# Altium project SLAVE_HW.PrjPcb (part 2 of 2)

## Sheet [4]Communication.SchDoc
size A4; DocumentNumber: 5; SheetNumber: 5; SheetTotal: 5
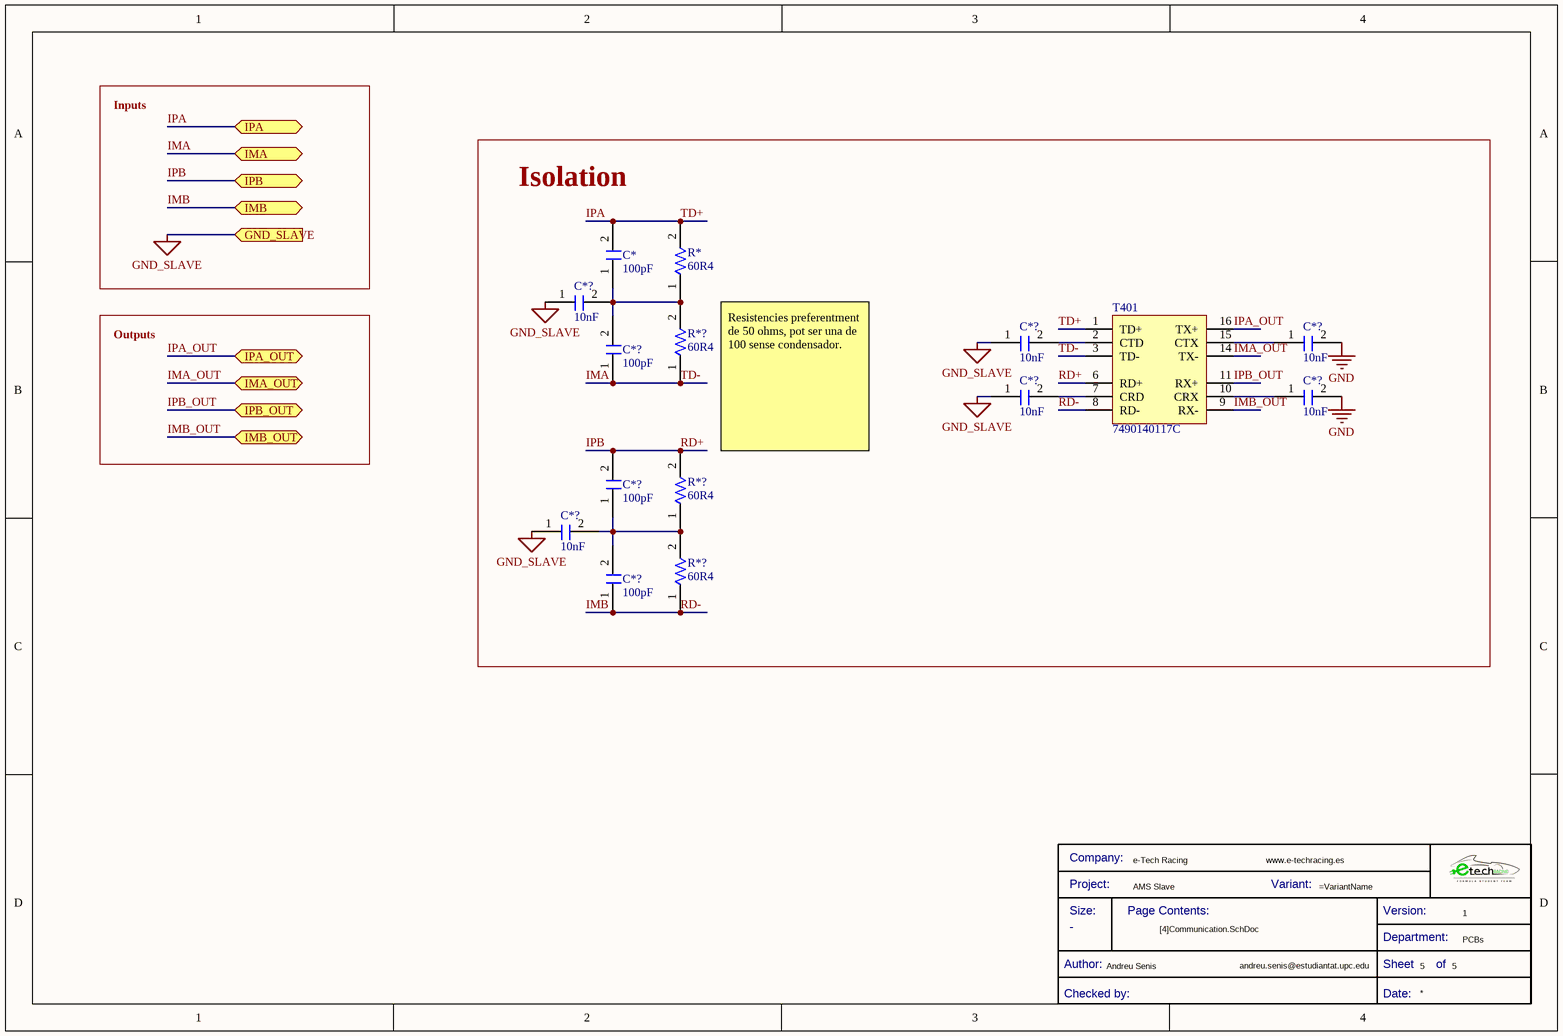
[diagram p4: [4]Communication.SchDoc]

### Parts
(Parts that share a designator on the sheet are numbered #1, #2 ... from top to bottom, then left to right.)
*?#4  Title Block_template  (value not drawn)  (graphical)
C*  Capacitance: 100pF  [C0805FNPC-W]  (hidden comment: 885012007057)
C*?#1  Capacitance: 10nF  [C0805FNPC-R]  (hidden comment: 885012207092)
C*?#2  Capacitance: 10nF  [C0805FNPC-R]  (hidden comment: 885012207092)
C*?#3  Capacitance: 10nF  [C0805FNPC-R]  (hidden comment: 885012207092)
C*?#4  Capacitance: 100pF  [C0805FNPC-W]  (hidden comment: 885012007057)
C*?#5  Capacitance: 10nF  [C0805FNPC-R]  (hidden comment: 885012207092)
C*?#6  Capacitance: 10nF  [C0805FNPC-R]  (hidden comment: 885012207092)
C*?#7  Capacitance: 100pF  [C0805FNPC-W]  (hidden comment: 885012007057)
C*?#8  Capacitance: 10nF  [C0805FNPC-R]  (hidden comment: 885012207092)
C*?#9  Capacitance: 100pF  [C0805FNPC-W]  (hidden comment: 885012007057)
R*  value 60R4  [R0805FTK]  (hidden comment: R60-0805FTN)
R*?#4  value 60R4  [R0805FTK]  (hidden comment: R60-0805FTN)
R*?#5  value 60R4  [R0805FTK]  (hidden comment: R60-0805FTN)
R*?#6  value 60R4  [R0805FTK]  (hidden comment: R60-0805FTN)
T401  7490140117C  [7490140117C]

### Blocks framed on the sheet
Isolation: C* C*?#1-C*?#9 R* R*?#4-R*?#6 T401

### Ports
GND_SLAVE (in), IMA (bidir), IMA_OUT (bidir), IMB (bidir), IMB_OUT (bidir), IPA (bidir), IPA_OUT (bidir), IPB (bidir), IPB_OUT (bidir)

### Nets
GND: C*?#3.2 C*?#6.2
GND_SLAVE: C*?#1.1 C*?#2.1 C*?#5.1 C*?#8.1 ; port GND_SLAVE  [project net C0]
IMA: C*?#4.1 R*?#4.1 T401.3(TD-) ; port IMA  [also labelled TD-]
IMA_OUT: T401.14(TX-) ; port IMA_OUT
IMB: C*?#9.1 R*?#6.1 T401.8(RD-) ; port IMB  [also labelled RD-]
IMB_OUT: T401.9(RX-) ; port IMB_OUT
IPA: C*.2 R*.2 T401.1(TD+) ; port IPA  [also labelled TD+]
IPA_OUT: T401.16(TX+) ; port IPA_OUT
IPB: C*?#7.2 R*?#5.2 T401.6(RD+) ; port IPB  [also labelled RD+]
IPB_OUT: T401.11(RX+) ; port IPB_OUT
NetC*?#2_2: C*?#2.2 T401.2(CTD)
NetC*?#3_1: C*?#3.1 T401.15(CTX)
NetC*?#5_2: C*?#5.2 T401.7(CRD)
NetC*?#6_1: C*?#6.1 T401.10(CRX)
NetC*?#7_1: C*?#7.1 C*?#8.2 C*?#9.2 R*?#5.1 R*?#6.2
NetC*_1: C*.1 C*?#1.2 C*?#4.2 R*.1 R*?#4.2

### Notes on the sheet
- Inputs
- Outputs
- (near R*?#4) Resistencies preferentment de 50 ohms, pot ser una de 100 sense condensador.
- (in symbol Title Block_template) Company:; Project:; Variant:; Size:; Page Contents:; Version:; Department:; Author:; Sheet; of; Checked by:; Date:

### Library data of the parts
*?#4 = Title Block_template: Standard Title Block; .Creator: GP; Category: Title Block; .PCBcheck: GP; .SCHcheck: GP; Size: -
C* C*?#4 C*?#7 C*?#9 = C100p-50V-0805FNPC-C0G/NP0: Multilayer Ceramic Capacitor, Wcap-Csgp Series, 100 Pf, 5%, C0G / Np0, 50 V, 0805 [2012 Metric] Rohs Compliant: Yes; Manufacturer: Wurth Electronics; Voltage Rating: 50V; .Creator: DR; Supplier 1: RSComponents; Manufacturer Part Number: 885012007057; RoHS: Yes; Category: Ceramic Capacitors; Stock 1: 1; Pricing 1: 4000=0,03900, 12000=0,03800 (USD); Mount: Surface Mount; Case/Package: 0805; Case Code (Metric): 2012; Case Code (Imperial): 0805; Min Operating Temperature: -55°C; Max Operating Temperature: 125°C; Packaging: Cut Tape; Dielectric: C0G; Tolerance: 5%; Voltage Rating (DC): 50V; Length: 0.079inch; Width: 0.049inch; Thickness: 0.035inch; REACH SVHC: Unknown; RoHS Compliant: Yes; ComponentLink1URL: http://www.farnell.com/datasheets/1958443.pdf?src-supplier=Farnell; ComponentLink1Description: http://www.farnell.com/datasheets/1958443.pdf?src-supplier=Farnell; ComponentLink2URL: https://katalog.we-online.de/pbs/datasheet/885012007057.pdf?src-supplier=Digi-Key; ComponentLink2Description: https://katalog.we-online.de/pbs/datasheet/885012007057.pdf?src-supplier=Digi-Key; ComponentLink3URL: http://www.farnell.com/datasheets/1958443.pdf?src-supplier=Element14; ComponentLink3Description: http://www.farnell.com/datasheets/1958443.pdf?src-supplier=Element14; ComponentLink4URL: http://www.farnell.com/datasheets/1958443.pdf?src-supplier=Newark; ComponentLink4Description: http://www.farnell.com/datasheets/1958443.pdf?src-supplier=Newark; ComponentLink5Description: Where buy it; ComponentLink5URL: https://www.we-online.com/catalog/en/WCAP-CSGP-50VDC#885012007057; Supplier Part Number 1: 1813930
C*?#1-C*?#3 C*?#5 C*?#6 C*?#8 = C10n-50V-0805FNPC-X7R: Cap, 0.01ΜF, 50V, 10%, X7R, 0805; Manufacturer 1: Wurth Electronics; .Creator: DR; Supplier 1: RSComponents; Manufacturer Part Number 1: 885012207092; RoHS: Yes; Category: Ceramic Capacitors; Stock 1: 1; Pricing 1: 4000=0,03200, 12000=0,03100 (USD); Mount: Surface Mount; Case/Package: 0805; Case Code (Metric): 2012; Case Code (Imperial): 0805; Min Operating Temperature: -55°C; Max Operating Temperature: 125°C; Packaging: Cut Tape; Voltage Rating: 50V; Dielectric: X7R; Tolerance: 10%; Voltage Rating (DC): 50V; Length: 0.079inch; Width: 0.049inch; Thickness: 0.035inch; REACH SVHC: Unknown; RoHS Compliant: Yes; ComponentLink1URL: http://www.farnell.com/datasheets/1958497.pdf?src-supplier=Farnell; ComponentLink1Description: http://www.farnell.com/datasheets/1958497.pdf?src-supplier=Farnell; ComponentLink2URL: http://www.farnell.com/datasheets/1958497.pdf?src-supplier=Element14; ComponentLink2Description: http://www.farnell.com/datasheets/1958497.pdf?src-supplier=Element14; ComponentLink3URL: http://www.farnell.com/datasheets/1958497.pdf?src-supplier=Newark; ComponentLink3Description: http://www.farnell.com/datasheets/1958497.pdf?src-supplier=Newark; ComponentLink4URL: https://katalog.we-online.de/pbs/datasheet/885012207092.pdf?src-supplier=Digi-Key; ComponentLink4Description: https://katalog.we-online.de/pbs/datasheet/885012207092.pdf?src-supplier=Digi-Key; Supplier Part Number 1: 1813941
R* R*?#4-R*?#6 = R60-0805FTN: Res Thin Film 0805 60.4 Ohm 0.1% 1/8W ±25ppm/°C Molded SMD SMD Punched Carrier T/R; Manufacturer 1: Panasonic; Manufacturer Part Number 1: ERA-6AEB60R4V; Resistance: 60.4R; Voltage Rating (DC): 100V; Max Power Dissipation: 125mW; Voltage Rating: 200V; .Creator: DR; Supplier 1: Arrow Electronics; RoHS: Yes; Category: Chip SMD Resistors; Stock 1: 5000; Pricing 1: 1=0,04650, 10=0,03900, 100=0,02860 (USD); Mount: Surface Mount; Case/Package: 0805; Number of Pins: 2; Contact Plating: Tin; Weight: 0.000194oz; Case Code (Metric): 2012; Case Code (Imperial): 0805; Min Operating Temperature: -55°C; Max Operating Temperature: 155°C; Temperature Coefficient: 25ppm/°C; Tolerance: 0.1%; Resistor Type: Thin Film,Metal Film; Features: Automotive AEC-Q200; Package Quantity: 5000; Number of Terminations: 2; Termination: SMD/SMT; Power Rating: 125mW; Packaging: Tape and Reel; Length: 2mm; Width: 1.25mm; Height: 0.5mm; Depth: 1.25mm; Radiation Hardening: No; Lead Free: Lead Free; ComponentLink1URL: https://datasheet.ciiva.com/11811/0900766b80eb1d8c-11811180.pdf?src-supplier=RSComponents; ComponentLink1Description: https://datasheet.ciiva.com/11811/0900766b80eb1d8c-11811180.pdf?src-supplier=RSComponents; ComponentLink2URL: https://datasheet.ciiva.com/41450/001181146-da-01-en-widerstand-era-0805-60r4-0-1-5000st-41450303.pdf?src-supplier=Conrad; ComponentLink2Description: https://datasheet.ciiva.com/41450/001181146-da-01-en-widerstand-era-0805-60r4-0-1-5000st-41450303.pdf?src-supplier=Conrad; ComponentLink3URL: https://datasheet.ciiva.com/5951/485442-5951173.pdf?src-supplier=Farnell; ComponentLink3Description: https://datasheet.ciiva.com/5951/485442-5951173.pdf?src-supplier=Farnell; ComponentLink4URL: https://datasheet.ciiva.com/30184/54aoa0000ce26-30184022.pdf?src-supplier=Onlinecomponents.com; ComponentLink4Description: https://datasheet.ciiva.com/30184/54aoa0000ce26-30184022.pdf?src-supplier=Onlinecomponents.com; ComponentLink5URL: https://datasheet.ciiva.com/9188/aoa0000ce26-9188476.pdf?src-supplier=Avnet; ComponentLink5Description: https://datasheet.ciiva.com/9188/aoa0000ce26-9188476.pdf?src-supplier=Avnet; Supplier Part Number 1: ERA-6AEB60R4V
T401 = TFMR_7490140117C

## Nets that join several sheets
+5: SLAVE_HW (J3.2 J4.2), [1]Supply (DCDC101.1)
+5_SLAVE: [1]Supply (Q101.3), [2]Balancing (C?#9.2 U?.37), [3]Temperatures (13 pins)
C0: [1]Supply (DCDC101.5), [2]Balancing (11 pins), [3]Temperatures (15 pins), [4]Communication (C*?#1.1 C*?#2.1 C*?#5.1 C*?#8.1)
GND: SLAVE_HW (J3.3 J4.3), [1]Supply (DCDC101.2), [4]Communication (C*?#3.2 C*?#6.2)
DRIVE: [1]Supply (Q101.1), [2]Balancing (U?.38)
IMA: [2]Balancing (U?.41), [4]Communication (C*?#4.1 R*?#4.1 T401.3)
IMA_OUT: SLAVE_HW (J3.4), [4]Communication (T401.14)
IMB: [2]Balancing (U?.47), [4]Communication (C*?#9.1 R*?#6.1 T401.8)
IMB_OUT: SLAVE_HW (J4.4), [4]Communication (T401.9)
IPA: [2]Balancing (U?.42), [4]Communication (C*.2 R*.2 T401.1)
IPA_OUT: SLAVE_HW (J3.1), [4]Communication (T401.16)
IPB: [2]Balancing (U?.48), [4]Communication (C*?#7.2 R*?#5.2 T401.6)
IPB_OUT: SLAVE_HW (J4.1), [4]Communication (T401.11)